# Altium project WQLT.PrjPcb
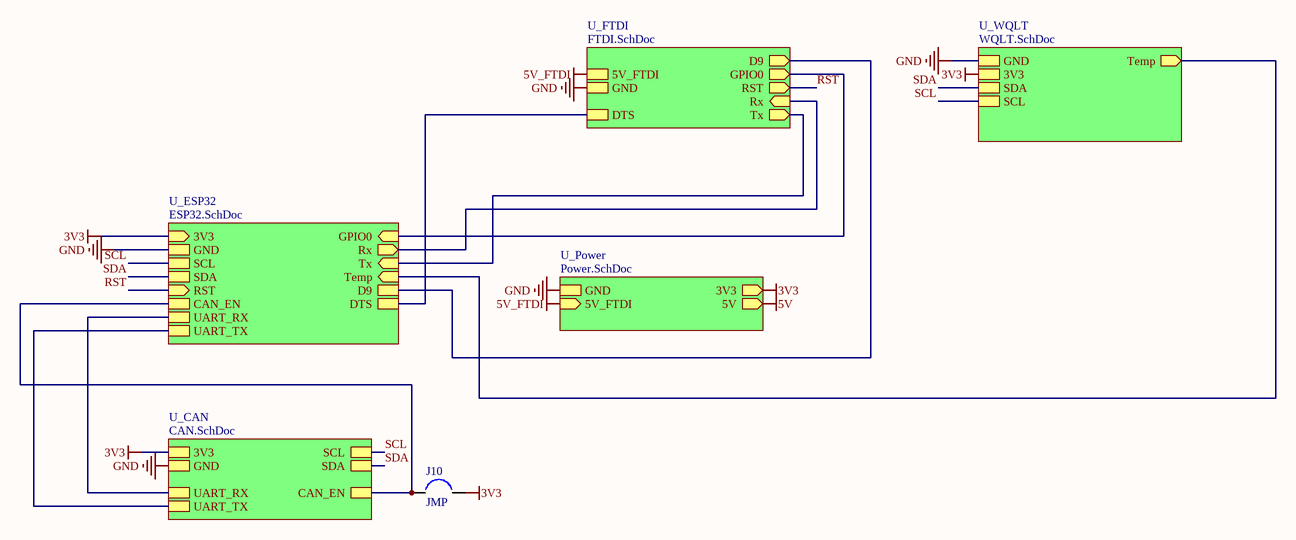
[diagram p0: MAIN.SchDoc]
13 sheets, 196 parts. Net scope: hierarchical (ports join the sheet entries above them; power ports are global).
Board file: PCB_WQLT.PcbDoc
Sheets:
  MAIN.SchDoc
    U_ESP32 = ESP32.SchDoc
    U_FTDI = FTDI.SchDoc
    U_WQLT = WQLT.SchDoc
      U_TDS_EZO_2 = TDS_EZO_2.SchDoc
      U_Temp = Temp.SchDoc
      U_DO_EZO_1 = DO_EZO_1.SchDoc
      U_TDS_EZO_1 = TDS_EZO_1.SchDoc
      U_DO_EZO_2 = DO_EZO_2.SchDoc
      U_pH_EZO_1 = pH_EZO_1.SchDoc
      U_pH_EZO_2 = pH_EZO_2.SchDoc
    U_Power = Power.SchDoc
    U_CAN = CAN.SchDoc

## Sheet MAIN.SchDoc
size A4

### Parts
J10  JMP  [Jumper]

### Sub-sheets
U_CAN = CAN.SchDoc: SDA, SCL, 3V3, CAN_EN, GND, UART_RX, UART_TX
U_ESP32 = ESP32.SchDoc: 3V3 (in), GND, SCL, SDA, GPIO0 (in), Temp (in), Tx (in), Rx (out), D9, RST (in), DTS, CAN_EN, UART_RX, UART_TX
U_FTDI = FTDI.SchDoc: D9 (out), RST (out), GND, Rx (in), Tx (out), 5V_FTDI, GPIO0 (out), DTS
U_Power = Power.SchDoc: 3V3 (out), GND, 5V (out), 5V_FTDI (in)
U_WQLT = WQLT.SchDoc: GND, Temp (out), 3V3, SDA, SCL

### Nets
3V3: J10.2 ; sheet U_ESP32/3V3, sheet U_WQLT/3V3, sheet U_Power/3V3, sheet U_CAN/3V3
5V_FTDI: sheet U_FTDI/5V_FTDI, sheet U_Power/5V_FTDI
GND: sheet U_ESP32/GND, sheet U_FTDI/GND, sheet U_WQLT/GND, sheet U_Power/GND, sheet U_CAN/GND
CAN_EN: J10.1 ; sheet U_ESP32/CAN_EN, sheet U_CAN/CAN_EN
D9: sheet U_ESP32/D9, sheet U_FTDI/D9
DTS: sheet U_ESP32/DTS, sheet U_FTDI/DTS
GPIO0: sheet U_ESP32/GPIO0, sheet U_FTDI/GPIO0
RST: sheet U_ESP32/RST, sheet U_FTDI/RST
Rx: sheet U_ESP32/Rx, sheet U_FTDI/Rx
SCL: sheet U_ESP32/SCL, sheet U_WQLT/SCL, sheet U_CAN/SCL
SDA: sheet U_ESP32/SDA, sheet U_WQLT/SDA, sheet U_CAN/SDA
Temp: sheet U_ESP32/Temp, sheet U_WQLT/Temp
Tx: sheet U_ESP32/Tx, sheet U_FTDI/Tx
UART_RX: sheet U_ESP32/UART_RX, sheet U_CAN/UART_RX
UART_TX: sheet U_ESP32/UART_TX, sheet U_CAN/UART_TX

## Sheet ESP32.SchDoc
size A4
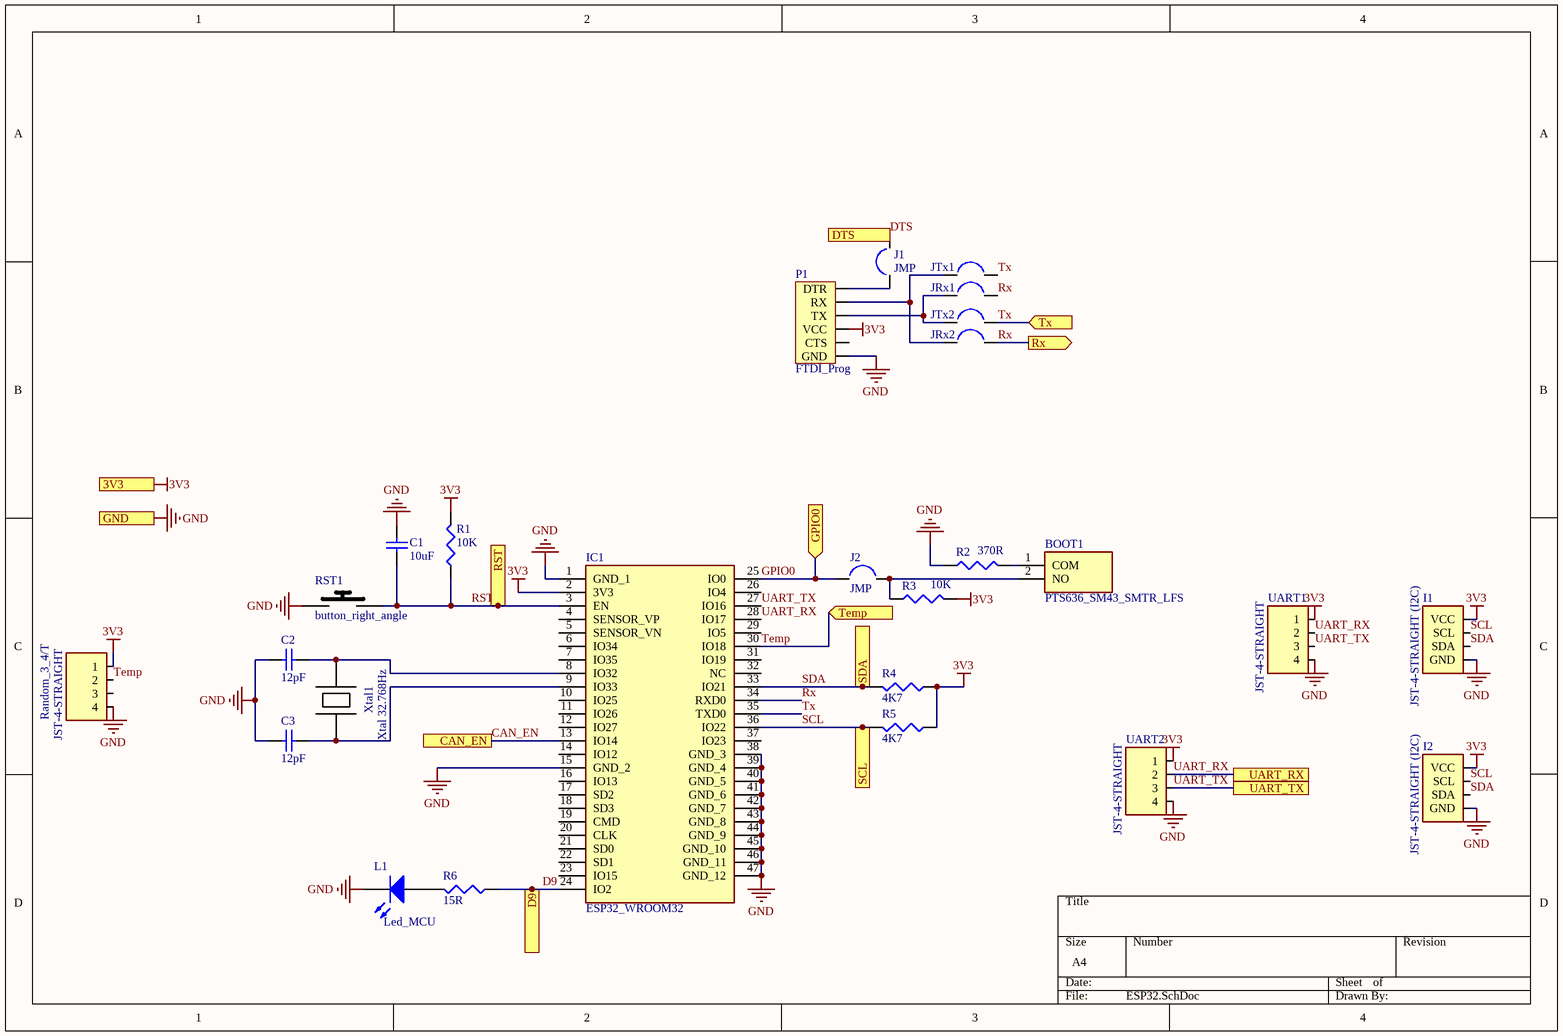
[diagram p1: ESP32.SchDoc]

### Parts
BOOT1  PTS636_SM43_SMTR_LFS  [PTS636SM43SMTRLFS]
C1  10uF  [1608[0603]]
C2  12pF  [1608[0603]]
C3  12pF  [1608[0603]]
I1  JST-4-STRAIGHT (I2C)  [JST-4-STRAIGHT]
I2  JST-4-STRAIGHT (I2C)  [JST-4-STRAIGHT]
IC1  ESP32_WROOM32  [ESP32WROOM32]
J1  JMP  [Jumper]
J2  JMP  [Jumper]
JRx1  JMP  [Jumper]  (value not drawn)
JRx2  JMP  [Jumper]  (value not drawn)
JTx1  JMP  [Jumper]  (value not drawn)
JTx2  JMP  [Jumper]  (value not drawn)
L1  Led_MCU  [LED 0603]
P1  FTDI_Prog  [programer]
R1  10K  [J1-0603]
R2  370R  [J1-0603]
R3  10K  [J1-0603]
R4  4K7  [J1-0603]
R5  4K7  [J1-0603]
R6  15R  [J1-0603]
Random_3_4/T  JST-4-STRAIGHT  [JST-4-STRAIGHT]
RST1  button_right_angle  [1825027-8]
UART1  JST-4-STRAIGHT  [JST-4-STRAIGHT]
UART2  JST-4-STRAIGHT  [JST-4-STRAIGHT]
Xtal1  Xtal 32.768Hz  [LFXTAL050789]

### Ports
3V3 (in), CAN_EN, D9, DTS, GND, GPIO0 (in), RST (in), Rx (out), SCL, SDA, Temp (in), Tx (in), UART_RX, UART_TX

### Nets
3V3: I1.1(VCC) I2.1(VCC) IC1.2(3V3) P1.4(VCC) R1.2 R3.2 R4.1 R5.1 Random_3_4/T.1 UART1.1 UART2.1 ; port 3V3
GND: C1.2 C2.2 C3.2 I1.4(GND) I2.4(GND) IC1.1(GND_1) IC1.15(GND_2) IC1.38(GND_3) IC1.39(GND_4) IC1.40(GND_5) IC1.41(GND_6) IC1.42(GND_7) IC1.43(GND_8) IC1.44(GND_9) IC1.45(GND_10) IC1.46(GND_11) IC1.47(GND_12) L1.2(K) P1.6(GND) R2.1 Random_3_4/T.4 RST1.1 UART1.4 UART2.4 ; port GND
CAN_EN: IC1.13(IO14) ; port CAN_EN
D9: IC1.24(IO2) R6.1 ; port D9
DTS: J1.2 ; port DTS
GPIO0: IC1.25(IO0) J2.1 ; port GPIO0
RST: C1.1 IC1.3(EN) R1.1 RST1.2 ; port RST
Rx: IC1.34(RXD0) JRx1.2 JRx2.2 ; port Rx
SCL: I1.2(SCL) I2.2(SCL) IC1.36(IO22) R5.2 ; port SCL
SDA: I1.3(SDA) I2.3(SDA) IC1.33(IO21) R4.2 ; port SDA
Temp: IC1.30(IO18) Random_3_4/T.2 ; port Temp
Tx: IC1.35(TXD0) JTx1.2 JTx2.2 ; port Tx
UART_RX: IC1.28(IO17) UART1.2 UART2.2 ; port UART_RX
UART_TX: IC1.27(IO16) UART1.3 UART2.3 ; port UART_TX
NetBOOT1_1: BOOT1.1(COM) R2.2
NetBOOT1_2: BOOT1.2(NO) J2.2 R3.1
NetC2_1: C2.1 IC1.8(IO32) Xtal1.2
NetC3_1: C3.1 IC1.9(IO33) Xtal1.1
NetJ1_1: J1.1 P1.1(DTR)
NetJRx1_1: JRx1.1 JTx2.1 P1.3(TX)
NetJRx2_1: JRx2.1 JTx1.1 P1.2(RX)
NetL1_1: L1.1(A) R6.2

Not connected (* = marked no-connect by the designer): IC1 4(SENSOR_VP) 5(SENSOR_VN) 6(IO34) 7(IO35) 10(IO25) 11(IO26) 12(IO27) 14(IO12) 16(IO13) 17(SD2) 18(SD3) 19(CMD) 20(CLK) 21(SD0) 22(SD1) 23(IO15) 26(IO4) 29(IO5) 31(IO19) 32(NC) 37(IO23); P1 5(CTS); Random_3_4/T 3

### Library data of the parts
BOOT1 = PTS636_SM43_SMTR_LFS: Switch; Manufacturer_Name: C & K COMPONENTS; Manufacturer_Part_Number: PTS636 SM43 SMTR LFS; Datasheet Link: https://componentsearchengine.com/Datasheets/1/PTS636 SM43 SMTR LFS.pdf; Height: 4.5mm; Mouser Part Number: 611-PTS636SM43SMTRLF; Mouser Price/Stock: https://www.mouser.co.uk/ProductDetail/CK/PTS636-SM43-SMTR-LFS?qs=vLWxofP3U2xu5raMGkTmHg%3D%3D; Arrow Part Number: PTS636 SM43 SMTR LFS; Arrow Price/Stock: https://www.arrow.com/en/products/pts636-sm43-smtr-lfs/ck
C1-C3 = Cap Semi: Capacitor (Semiconductor SIM Model); Published: 8-Jun-2000; LatestRevisionDate: 29-May-2009; LatestRevisionNote: IPC-7351 Footprint Added.; PackageReference: C1206; Publisher: Altium Limited; PackageDescription: Chip Capacitor
  C1: Value: 10uF
  C2 C3: Value: 12pF
IC1 = ESP32_WROOM32: Integrated Circuit; Manufacturer_Name: Espressif Systems; Manufacturer_Part_Number: ESP32 WROOM32; Datasheet Link: https://www.espressif.com/sites/default/files/documentation/esp32-wroom-32_datasheet_en.pdf; Height: 3.2mm
L1 = LED3: Typical BLUE SiC LED; Published: 8-Jun-2000; LatestRevisionDate: 17-Dec-2003; LatestRevisionNote: PCB Footprint replaced.; DatasheetVersion: 16-Apr-2002; PackageVersion: 16-Apr-2002; PackageReference: 3.5X2.8X1.9; Publisher: Altium Limited; PackageDescription: SM LED; 2 C-Bend Leads; Body 3.5 x 2.8 x 1.9 mm, inc leads (LxWxH typ)
P1 = Programer: FTDI_programer FT232RL USB TO TTL
R1-R6 = Res3: Resistor; Published: 8-Jun-2000; LatestRevisionDate: 29-May-2009; LatestRevisionNote: IPC-7351 Footprint Added.; PackageReference: J1-0603; Publisher: Altium Limited; PackageDescription: Chip Resistor
  R1 R3: Value: 10K
  R2: Value: 370R
  R4 R5: Value: 4K7
  R6: Value: 15R
RST1 = button_right_angle: Switch; Manufacturer_Name: TE Connectivity; Datasheet Link: http://www.te.com/commerce/DocumentDelivery/DDEController?Action=srchrtrv&DocNm=1825027&DocType=Customer+Drawing&DocLang=English; Manufacturer_Part_Number: 1825027-8; Mouser Part Number: 506-1825027-8; Mouser Price/Stock: https://www.mouser.com/Search/Refine.aspx?Keyword=506-1825027-8; RS Part Number: 7182389P; RS Price/Stock: http://uk.rs-online.com/web/p/products/7182389P
Xtal1 = Crystals WE-XTAL 32.7680kHz: 32.7680kHz; Shop: https://www.mouser.sk/ProductDetail/Wurth-Elektronik/830050789?qs=2WXlatMagcG%2Fhb4pC63Fuw%3D%3D

## Sheet FTDI.SchDoc
size A4
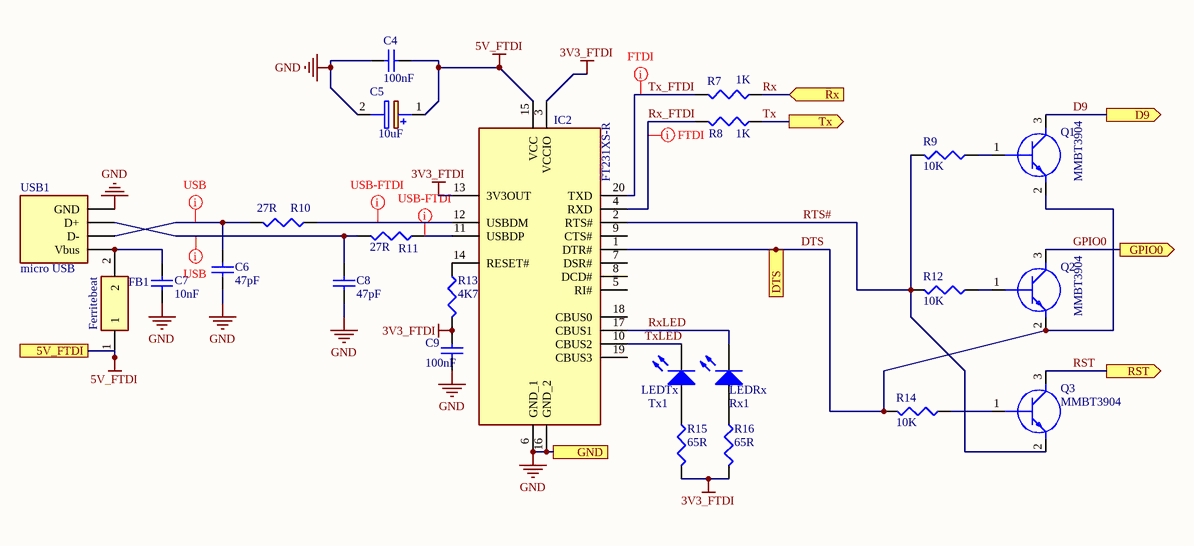
[diagram p2: FTDI.SchDoc]

### Parts
C4  100nF  [1608[0603]]
C5  10uF  [CAPPM3216X180N]
C6  47pF  [1608[0603]]
C7  10nF  [1608[0603]]
C8  47pF  [1608[0603]]
C9  100nF  [1608[0603]]
FB1  Ferritebeat  [BEADC1608X95N]
IC2  FT231XS-R  [SOP64P599X175-20N]
Q1  MMBT3904  [SOT95P230X110-3N]
Q2  MMBT3904  [SOT95P230X110-3N]
Q3  MMBT3904  [SOT95P230X110-3N]
R7  1K  [J1-0603]
R8  1K  [J1-0603]
R9  10K  [J1-0603]
R10  27R  [J1-0603]
R11  27R  [J1-0603]
R12  10K  [J1-0603]
R13  4K7  [J1-0603]
R14  10K  [J1-0603]
R15  65R  [J1-0603]
R16  65R  [J1-0603]
Rx1  LEDRx  [LED 0603]
Tx1  LEDTx  [LED 0603]
USB1  micro USB  [micro USB]

### Ports
5V_FTDI, D9 (out), DTS, GND, GPIO0 (out), RST (out), Rx (in), Tx (out)

### Nets
3V3_FTDI: C9.1 IC2.3(VCCIO) IC2.13(3V3OUT) R13.2 R15.2 R16.2
5V_FTDI: C4.2 C5.1(+) FB1.1 IC2.15(VCC) ; port 5V_FTDI
GND: C4.1 C5.2(-) C6.2 C7.1 C8.2 C9.2 IC2.6(GND_1) IC2.16(GND_2) USB1.5(GND) ; port GND
D9: Q1.3(C) ; port D9
DTS: IC2.1(DTR#) Q1.2(E) Q2.2(E) R14.2 ; port DTS
GPIO0: Q2.3(C) ; port GPIO0
RST: Q3.3(C) ; port RST
RTS#: IC2.2(RTS#) Q3.2(E) R9.2 R12.2
Rx: R7.1 ; port Rx
Rx_FTDI: IC2.4(RXD) R8.2
RxLED: IC2.17(CBUS1) Rx1.2(K)
Tx: R8.1 ; port Tx
Tx_FTDI: IC2.20(TXD) R7.2
TxLED: IC2.10(CBUS2) Tx1.2(K)
NetC6_1: C6.1 R10.2 USB1.2(D-)
NetC7_2: C7.2 FB1.2 USB1.1(Vbus)
NetC8_1: C8.1 R11.2 USB1.3(D+)
NetIC2_11: IC2.11(USBDP) R11.1
NetIC2_12: IC2.12(USBDM) R10.1
NetIC2_14: IC2.14(RESET#) R13.1
NetQ1_1: Q1.1(B) R9.1
NetQ2_1: Q2.1(B) R12.1
NetQ3_1: Q3.1(B) R14.1
NetR15_1: R15.1 Tx1.1(A)
NetR16_1: R16.1 Rx1.1(A)

Not connected (* = marked no-connect by the designer): IC2 5(RI#) 7(DSR#) 8(DCD#) 9(CTS#) 18(CBUS0) 19(CBUS3)

### Layout directives
net class USB: NetC6_1, NetC8_1
net class FTDI: Rx_FTDI, Tx_FTDI
net class USB-FTDI: NetIC2_11, NetIC2_12

### Library data of the parts
C4 C9 = Cap Semi: Capacitor (Semiconductor SIM Model); Value: 47pF; Published: 8-Jun-2000; LatestRevisionDate: 29-May-2009; LatestRevisionNote: IPC-7351 Footprint Added.; PackageReference: C1206; Publisher: Altium Limited; PackageDescription: Chip Capacitor
C5 = TAJA106K004RNJ: Capacitor Polarised; Manufacturer_Name: AVX; Datasheet Link: http://www.farnell.com/datasheets/1680476.pdf; Height: 1.8mm; Manufacturer_Part_Number: TAJA106K004RNJ; Mouser Part Number: 581-TAJA106K004R; Mouser Price/Stock: https://www.mouser.com/Search/Refine.aspx?Keyword=581-TAJA106K004R
C6-C8 = Cap Semi: Capacitor (Semiconductor SIM Model); Published: 8-Jun-2000; LatestRevisionDate: 29-May-2009; LatestRevisionNote: IPC-7351 Footprint Added.; PackageReference: C1206; Publisher: Altium Limited; PackageDescription: Chip Capacitor
  C6 C8: Value: 47pF
  C7: Value: 10nF
FB1 = BLM18DN151SH1D: Ferrite Bead; Manufacturer_Name: Murata Electronics; Datasheet Link: http://www.murata.com/~/media/webrenewal/support/library/catalog/products/emc/emifil/c31e.ashx?la=en-gb; Height: 0.95mm; Manufacturer_Part_Number: BLM18DN151SH1D; Mouser Part Number: 81-BLM18DN151SH1D; Mouser Price/Stock: https://www.mouser.com/Search/Refine.aspx?Keyword=81-BLM18DN151SH1D
IC2 = FT231XS-R: Integrated Circuit; Manufacturer_Name: FTDI Chip; Datasheet Link: http://docs-emea.rs-online.com/webdocs/1102/0900766b811020d3.pdf; Height: 1.753mm; Manufacturer_Part_Number: FT231XS-R; Mouser Part Number: 895-FT231XS-R; Mouser Price/Stock: https://www.mouser.co.uk/ProductDetail/FTDI/FT231XS-R?qs=Gp1Yz1mis3WduRPsgrTbtg%3D%3D; Arrow Part Number: FT231XS-R; Arrow Price/Stock: https://www.arrow.com/en/products/ft231xs-r/ftdi-chip
Q1-Q3 = MMBT3904,215: Transistor BJT NPN; Manufacturer_Name: Nexperia; Datasheet Link: http://assets.nexperia.com/documents/data-sheet/MMBT3904.pdf; Height: 1.1mm; Manufacturer_Part_Number: MMBT3904,215; Mouser Part Number: 771-MMBT3904T/R; Mouser Price/Stock: https://www.mouser.co.uk/ProductDetail/Nexperia/MMBT3904215?qs=LOCUfHb8d9s%2FW6hzAJGDbw%3D%3D; Arrow Part Number: MMBT3904,215; Arrow Price/Stock: https://www.arrow.com/en/products/mmbt3904215/nexperia?region=europe
R7-R16 = Res3: Resistor; Published: 8-Jun-2000; LatestRevisionDate: 29-May-2009; LatestRevisionNote: IPC-7351 Footprint Added.; PackageReference: J1-0603; Publisher: Altium Limited; PackageDescription: Chip Resistor
  R7 R8: Value: 1K
  R9 R12 R14: Value: 10K
  R10 R11: Value: 27R
  R13: Value: 4K7
  R15 R16: Value: 65R
Rx1 Tx1 = LED3: Typical BLUE SiC LED; Published: 8-Jun-2000; LatestRevisionDate: 17-Dec-2003; LatestRevisionNote: PCB Footprint replaced.; DatasheetVersion: 16-Apr-2002; PackageVersion: 16-Apr-2002; PackageReference: 3.5X2.8X1.9; Publisher: Altium Limited; PackageDescription: SM LED; 2 C-Bend Leads; Body 3.5 x 2.8 x 1.9 mm, inc leads (LxWxH typ)

## Sheet WQLT.SchDoc
size A4
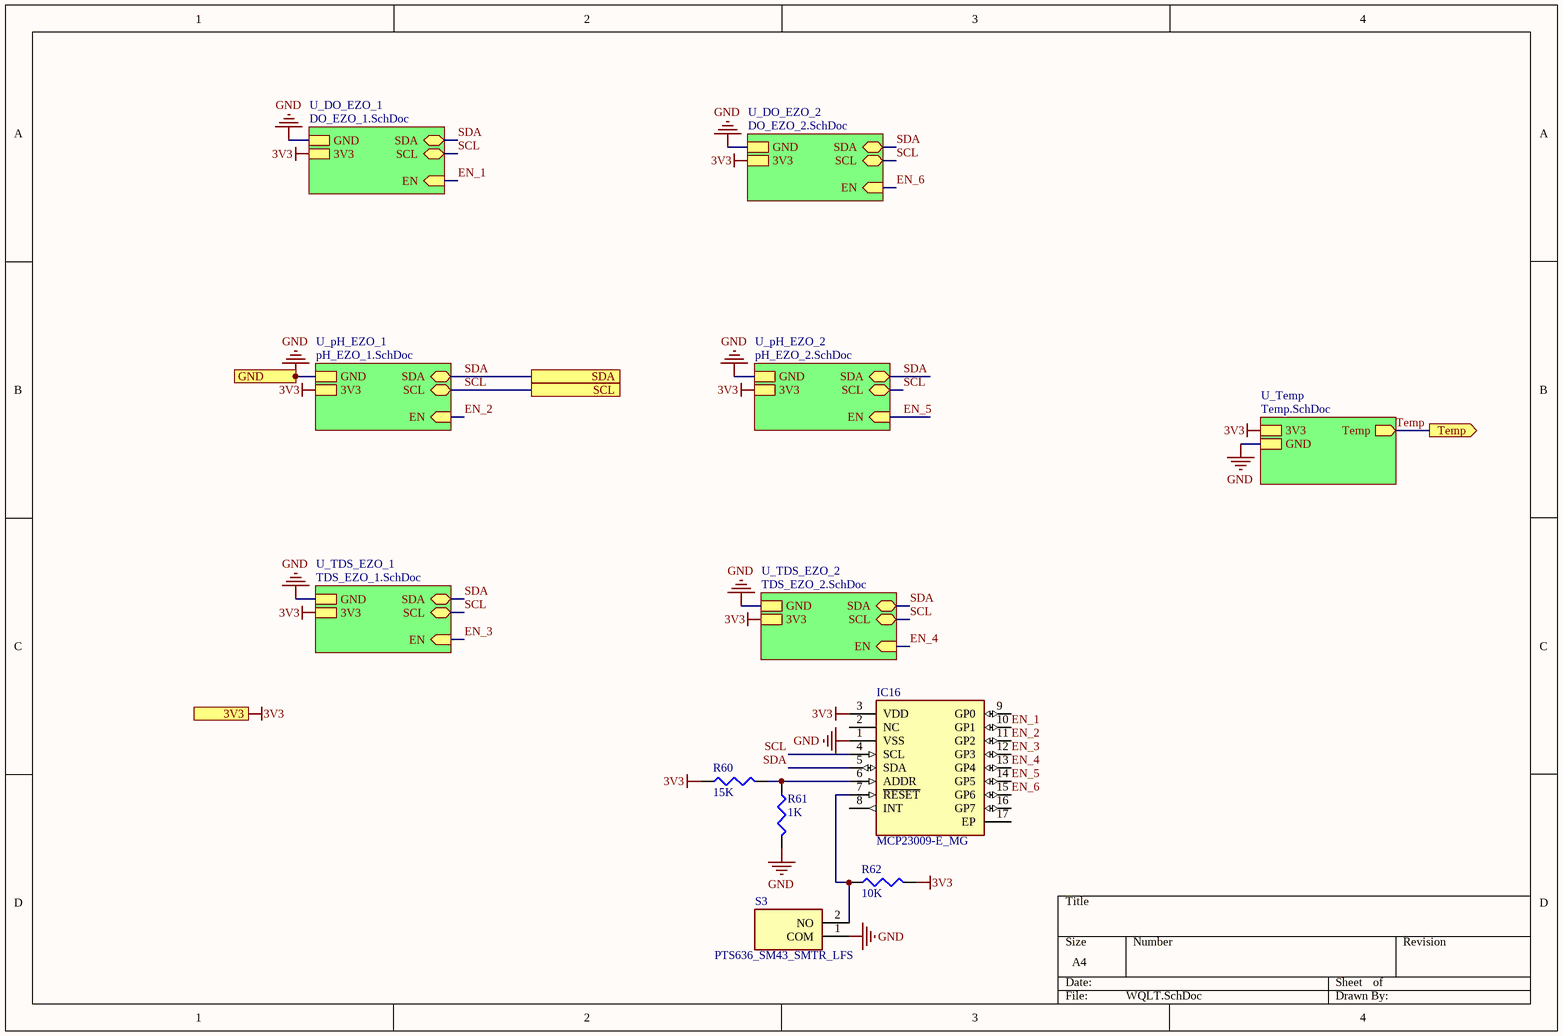
[diagram p3: WQLT.SchDoc]

### Parts
IC16  MCP23009-E_MG  [QFN50P300X300X90-17N-D]
R60  15K  [J1-0603]
R61  1K  [J1-0603]
R62  10K  [J1-0603]
S3  PTS636_SM43_SMTR_LFS  [PTS636SM43SMTRLFS]

### Sub-sheets
U_DO_EZO_1 = DO_EZO_1.SchDoc: SCL (bidir), GND, EN (in), SDA (bidir), 3V3
U_DO_EZO_2 = DO_EZO_2.SchDoc: SCL (bidir), GND, EN (in), SDA (bidir), 3V3
U_pH_EZO_1 = pH_EZO_1.SchDoc: SDA (bidir), EN (in), SCL (bidir), GND, 3V3
U_pH_EZO_2 = pH_EZO_2.SchDoc: SDA (bidir), EN (in), 3V3, SCL (bidir), GND
U_TDS_EZO_1 = TDS_EZO_1.SchDoc: SDA (bidir), EN (in), SCL (bidir), 3V3, GND
U_TDS_EZO_2 = TDS_EZO_2.SchDoc: SDA (bidir), EN (in), SCL (bidir), 3V3, GND
U_Temp = Temp.SchDoc: 3V3, Temp (out), GND

### Ports
3V3, GND, SCL, SDA, Temp (out)

### Nets
3V3: IC16.3(VDD) R60.1 R62.2 ; port 3V3, sheet U_TDS_EZO_2/3V3, sheet U_Temp/3V3, sheet U_DO_EZO_1/3V3, sheet U_TDS_EZO_1/3V3, sheet U_DO_EZO_2/3V3, sheet U_pH_EZO_1/3V3, sheet U_pH_EZO_2/3V3
GND: IC16.1(VSS) R61.2 S3.1(COM) ; port GND, sheet U_TDS_EZO_2/GND, sheet U_Temp/GND, sheet U_DO_EZO_1/GND, sheet U_TDS_EZO_1/GND, sheet U_DO_EZO_2/GND, sheet U_pH_EZO_1/GND, sheet U_pH_EZO_2/GND
EN_1: IC16.10(GP1) ; sheet U_DO_EZO_1/EN
EN_2: IC16.11(GP2) ; sheet U_pH_EZO_1/EN
EN_3: IC16.12(GP3) ; sheet U_TDS_EZO_1/EN
EN_4: IC16.13(GP4) ; sheet U_TDS_EZO_2/EN
EN_5: IC16.14(GP5) ; sheet U_pH_EZO_2/EN
EN_6: IC16.15(GP6) ; sheet U_DO_EZO_2/EN
SCL: IC16.4(SCL) ; port SCL, sheet U_TDS_EZO_2/SCL, sheet U_DO_EZO_1/SCL, sheet U_TDS_EZO_1/SCL, sheet U_DO_EZO_2/SCL, sheet U_pH_EZO_1/SCL, sheet U_pH_EZO_2/SCL
SDA: IC16.5(SDA) ; port SDA, sheet U_TDS_EZO_2/SDA, sheet U_DO_EZO_1/SDA, sheet U_TDS_EZO_1/SDA, sheet U_DO_EZO_2/SDA, sheet U_pH_EZO_1/SDA, sheet U_pH_EZO_2/SDA
Temp: port Temp, sheet U_Temp/Temp
NetIC16_6: IC16.6(ADDR) R60.2 R61.1
NetIC16_7: IC16.7(~{RESET}) R62.1 S3.2(NO)

Not connected (* = marked no-connect by the designer): IC16 2(NC) 8(INT) 9(GP0) 16(GP7) 17(EP)

### Library data of the parts
IC16 = MCP23009-E_MG: Integrated Circuit; Manufacturer_Name: Microchip; Manufacturer_Part_Number: MCP23009-E/MG; Datasheet Link: http://ww1.microchip.com/downloads/en/DeviceDoc/20002121C.pdf; Height: 0.9mm; Mouser Part Number: 579-MCP23009-E/MG; Mouser Price/Stock: https://www.mouser.co.uk/ProductDetail/Microchip-Technology/MCP23009-E-MG?qs=Xb8IjHhkxj5%2FhepKZpS8CQ%3D%3D; Arrow Part Number: MCP23009-E/MG; Arrow Price/Stock: https://www.arrow.com/en/products/mcp23009-emg/microchip-technology
R60-R62 = Res3: Resistor; Published: 8-Jun-2000; LatestRevisionDate: 29-May-2009; LatestRevisionNote: IPC-7351 Footprint Added.; PackageReference: J1-0603; Publisher: Altium Limited; PackageDescription: Chip Resistor
  R60: Value: 15K
  R61: Value: 1K
  R62: Value: 10K
S3 = PTS636_SM43_SMTR_LFS: as BOOT1 on sheet ESP32; Datasheet Link: https://componentsearchengine.com/Datasheets/1/PTS636 SM43 SMTR LFS.pdf; Height: 4.5mm; Mouser Part Number: 611-PTS636SM43SMTRLF; Mouser Price/Stock: https://www.mouser.co.uk/ProductDetail/CK/PTS636-SM43-SMTR-LFS?qs=vLWxofP3U2xu5raMGkTmHg%3D%3D; Arrow Part Number: PTS636 SM43 SMTR LFS; Arrow Price/Stock: https://www.arrow.com/en/products/pts636-sm43-smtr-lfs/ck

## Sheet TDS_EZO_2.SchDoc
size A4
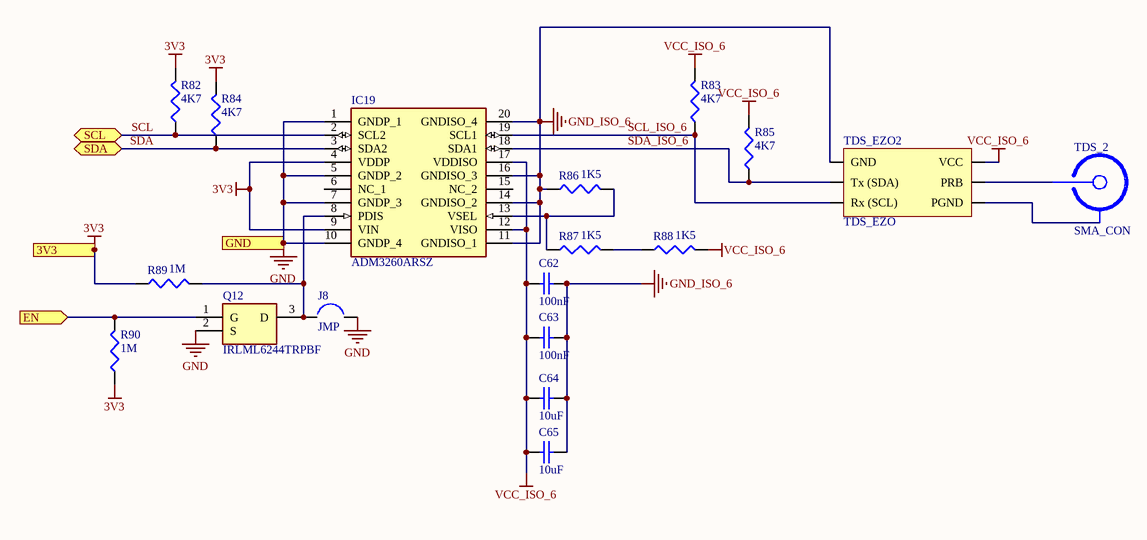
[diagram p4: TDS_EZO_2.SchDoc]

### Parts
C62  100nF  [1608[0603]]
C63  100nF  [1608[0603]]
C64  10uF  [1608[0603]]
C65  10uF  [1608[0603]]
IC19  ADM3260ARSZ  [SOP65P780X200-20N]
J8  JMP  [Jumper]
Q12  IRLML6244TRPBF  [SOT95P237X112-3N]
R82  4K7  [J1-0603]
R83  4K7  [J1-0603]
R84  4K7  [J1-0603]
R85  4K7  [J1-0603]
R86  1K5  [J1-0603]
R87  1K5  [J1-0603]
R88  1K5  [J1-0603]
R89  1M  [J1-0603]
R90  1M  [J1-0603]
TDS_2  SMA_CON  [PCBSMAFRAHT]
TDS_EZO2  TDS_EZO  [TDS_EZO]

### Ports
3V3, EN (in), GND, SCL (bidir), SDA (bidir)

### Nets
3V3: IC19.4(VDDP) IC19.9(VIN) R82.2 R84.2 R89.1 R90.1 ; port 3V3
GND: IC19.1(GNDP_1) IC19.5(GNDP_2) IC19.7(GNDP_3) IC19.10(GNDP_4) J8.2 Q12.2(S) ; port GND
GND_ISO_6: C62.2 C63.2 C64.2 C65.2 IC19.11(GNDISO_1) IC19.14(GNDISO_2) IC19.16(GNDISO_3) IC19.20(GNDISO_4) R86.1 TDS_EZO2.1(GND)
VCC_ISO_6: C62.1 C63.1 C64.1 C65.1 IC19.12(VISO) IC19.17(VDDISO) R83.2 R85.2 R88.2 TDS_EZO2.4(VCC)
EN_4: Q12.1(G) R90.2 ; port EN
SCL: IC19.2(SCL2) R82.1 ; port SCL
SCL_ISO_6: IC19.19(SCL1) R83.1 TDS_EZO2.3(Rx_(SCL))
SDA: IC19.3(SDA2) R84.1 ; port SDA
SDA_ISO_6: IC19.18(SDA1) R85.1 TDS_EZO2.2(Tx_(SDA))
NetIC19_8: IC19.8(PDIS) J8.1 Q12.3(D) R89.2
NetIC19_13: IC19.13(VSEL) R86.2 R87.1
NetR87_2: R87.2 R88.1
NetTDS_2_1: TDS_2.1 TDS_EZO2.5(PRB)
NetTDS_2_2: TDS_2.2 TDS_EZO2.6(PGND)

Not connected (* = marked no-connect by the designer): IC19 6(NC_1) 15(NC_2)

### Library data of the parts
C62 C63 = Cap Semi: Capacitor (Semiconductor SIM Model); Published: 8-Jun-2000; LatestRevisionDate: 29-May-2009; LatestRevisionNote: IPC-7351 Footprint Added.; PackageReference: C1206; Publisher: Altium Limited; PackageDescription: Chip Capacitor; Value: 100nF
C64 C65 = Cap Semi: Capacitor (Semiconductor SIM Model); Value: 100nF; Published: 8-Jun-2000; LatestRevisionDate: 29-May-2009; LatestRevisionNote: IPC-7351 Footprint Added.; PackageReference: C1206; Publisher: Altium Limited; PackageDescription: Chip Capacitor
IC19 = ADM3260ARSZ: Integrated Circuit; Manufacturer_Name: Analog Devices; Datasheet Link: http://www.farnell.com/datasheets/2037088.pdf; Height: 2mm; Manufacturer_Part_Number: ADM3260ARSZ; Mouser Part Number: 584-ADM3260ARSZ; Mouser Price/Stock: https://www.mouser.com/Search/Refine.aspx?Keyword=584-ADM3260ARSZ; RS Part Number: 8319113P; RS Price/Stock: http://uk.rs-online.com/web/p/products/8319113P
Q12 = IRLML6244TRPBF: Transistor; Manufacturer_Name: Infineon; Allied_Number: 70411468; Datasheet Link: http://www.infineon.com/dgdl/irlml6244pbf.pdf?fileId=5546d462533600a4015356686fed261f; Height: 1.12mm; Manufacturer_Part_Number: IRLML6244TRPBF; Mouser Part Number: 942-IRLML6244TRPBF; Mouser Price/Stock: https://www.mouser.com/Search/Refine.aspx?Keyword=942-IRLML6244TRPBF; RS Part Number: 7377228P; RS Price/Stock: http://at.rs-online.com/web/p/products/7377228P; Allied Price/Stock: https://www.alliedelec.com/infineon-irlml6244trpbf/70411468/
R82-R90 = Res3: Resistor; Published: 8-Jun-2000; LatestRevisionDate: 29-May-2009; LatestRevisionNote: IPC-7351 Footprint Added.; PackageReference: J1-0603; Publisher: Altium Limited; PackageDescription: Chip Resistor
  R82-R85: Value: 4K7
  R86-R88: Value: 1K5
  R89 R90: Value: 1M
TDS_2 = SMA: Connector; Manufacturer_Name: Taoglas; Manufacturer_Part_Number: PCB.SMAFRA.HT; Datasheet Link: https://www.mouser.com/datasheet/2/398/PCB.SMAFRA.HT_-1220750.pdf; Height: 9mm; Mouser Part Number: 960-PCB.SMAFRA.HT; Mouser Price/Stock: https://www.mouser.co.uk/ProductDetail/Taoglas/PCBSMAFRAHT?qs=RuW%2Fu%252BNMQmubIFYcN8w5Dw%3D%3D

## Sheet Temp.SchDoc
size A4
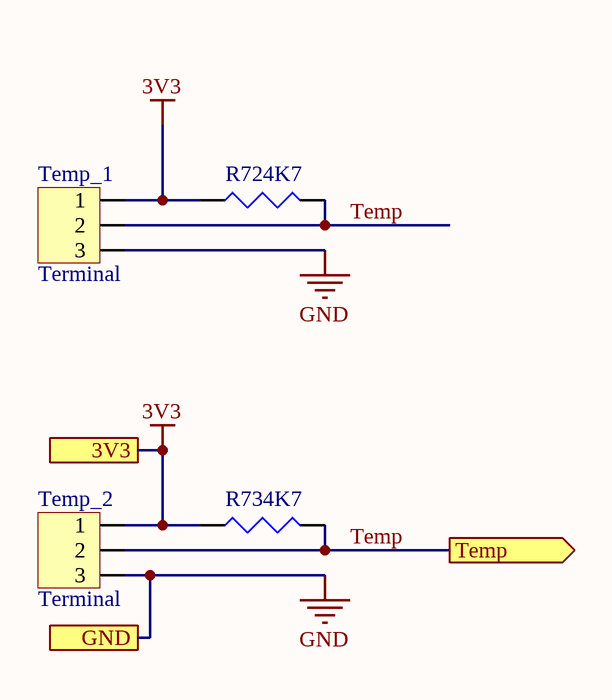
[diagram p5: Temp.SchDoc]

### Parts
R72  4K7  [J1-0603]
R73  4K7  [J1-0603]
Temp_1  Terminal  [2,54 3pin terminal]
Temp_2  Terminal  [2,54 3pin terminal]

### Ports
3V3, GND, Temp (out)

### Nets
3V3: R72.1 R73.1 Temp_1.1 Temp_2.1 ; port 3V3
GND: Temp_1.3 Temp_2.3 ; port GND
Temp: R72.2 R73.2 Temp_1.2 Temp_2.2 ; port Temp

### Library data of the parts
R72 R73 = Res3: Resistor; Published: 8-Jun-2000; LatestRevisionDate: 29-May-2009; LatestRevisionNote: IPC-7351 Footprint Added.; PackageReference: J1-0603; Publisher: Altium Limited; PackageDescription: Chip Resistor; Value: 4K7
Temp_1 Temp_2 = 2,54 3pin terminal

## Sheet DO_EZO_1.SchDoc
size A4
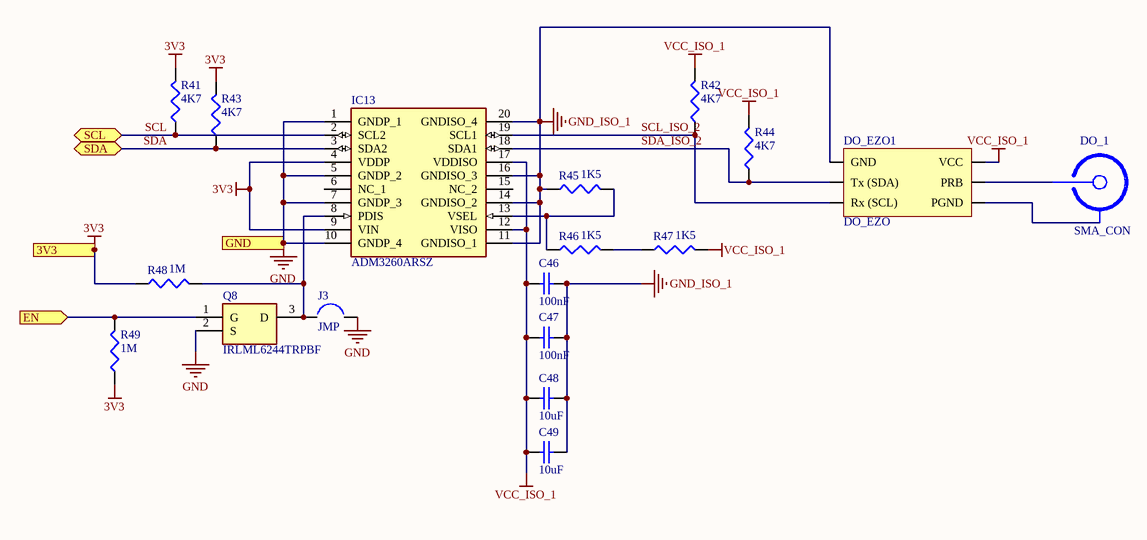
[diagram p6: DO_EZO_1.SchDoc]

### Parts
C46  100nF  [1608[0603]]
C47  100nF  [1608[0603]]
C48  10uF  [1608[0603]]
C49  10uF  [1608[0603]]
DO_1  SMA_CON  [PCBSMAFRAHT]
DO_EZO1  DO_EZO  [DO_EZO]
IC13  ADM3260ARSZ  [SOP65P780X200-20N]
J3  JMP  [Jumper]
Q8  IRLML6244TRPBF  [SOT95P237X112-3N]
R41  4K7  [J1-0603]
R42  4K7  [J1-0603]
R43  4K7  [J1-0603]
R44  4K7  [J1-0603]
R45  1K5  [J1-0603]
R46  1K5  [J1-0603]
R47  1K5  [J1-0603]
R48  1M  [J1-0603]
R49  1M  [J1-0603]

### Ports
3V3, EN (in), GND, SCL (bidir), SDA (bidir)

### Nets
3V3: IC13.4(VDDP) IC13.9(VIN) R41.2 R43.2 R48.1 R49.1 ; port 3V3
GND: IC13.1(GNDP_1) IC13.5(GNDP_2) IC13.7(GNDP_3) IC13.10(GNDP_4) J3.2 Q8.2(S) ; port GND
GND_ISO_1: C46.2 C47.2 C48.2 C49.2 DO_EZO1.1(GND) IC13.11(GNDISO_1) IC13.14(GNDISO_2) IC13.16(GNDISO_3) IC13.20(GNDISO_4) R45.1
VCC_ISO_1: C46.1 C47.1 C48.1 C49.1 DO_EZO1.4(VCC) IC13.12(VISO) IC13.17(VDDISO) R42.2 R44.2 R47.2
EN_1: Q8.1(G) R49.2 ; port EN
SCL: IC13.2(SCL2) R41.1 ; port SCL
SCL_ISO_2: DO_EZO1.3(Rx_(SCL)) IC13.19(SCL1) R42.1
SDA: IC13.3(SDA2) R43.1 ; port SDA
SDA_ISO_2: DO_EZO1.2(Tx_(SDA)) IC13.18(SDA1) R44.1
NetDO_1_1: DO_1.1 DO_EZO1.5(PRB)
NetDO_1_2: DO_1.2 DO_EZO1.6(PGND)
NetIC13_8: IC13.8(PDIS) J3.1 Q8.3(D) R48.2
NetIC13_13: IC13.13(VSEL) R45.2 R46.1
NetR46_2: R46.2 R47.1

Not connected (* = marked no-connect by the designer): IC13 6(NC_1) 15(NC_2)

### Library data of the parts
C46 C47 = Cap Semi: Capacitor (Semiconductor SIM Model); Published: 8-Jun-2000; LatestRevisionDate: 29-May-2009; LatestRevisionNote: IPC-7351 Footprint Added.; PackageReference: C1206; Publisher: Altium Limited; PackageDescription: Chip Capacitor; Value: 100nF
C48 C49 = Cap Semi: as C64 on sheet TDS_EZO_2; Published: 8-Jun-2000; LatestRevisionDate: 29-May-2009; LatestRevisionNote: IPC-7351 Footprint Added.; PackageReference: C1206; Publisher: Altium Limited; PackageDescription: Chip Capacitor
DO_1 = SMA: as TDS_2 on sheet TDS_EZO_2; Datasheet Link: https://www.mouser.com/datasheet/2/398/PCB.SMAFRA.HT_-1220750.pdf; Height: 9mm; Mouser Part Number: 960-PCB.SMAFRA.HT; Mouser Price/Stock: https://www.mouser.co.uk/ProductDetail/Taoglas/PCBSMAFRAHT?qs=RuW%2Fu%252BNMQmubIFYcN8w5Dw%3D%3D
IC13 = ADM3260ARSZ: as IC19 on sheet TDS_EZO_2; Datasheet Link: http://www.farnell.com/datasheets/2037088.pdf; Height: 2mm; Manufacturer_Part_Number: ADM3260ARSZ; Mouser Part Number: 584-ADM3260ARSZ; Mouser Price/Stock: https://www.mouser.com/Search/Refine.aspx?Keyword=584-ADM3260ARSZ; RS Part Number: 8319113P; RS Price/Stock: http://uk.rs-online.com/web/p/products/8319113P
Q8 = IRLML6244TRPBF: as Q12 on sheet TDS_EZO_2; Datasheet Link: http://www.infineon.com/dgdl/irlml6244pbf.pdf?fileId=5546d462533600a4015356686fed261f; Height: 1.12mm; Manufacturer_Part_Number: IRLML6244TRPBF; Mouser Part Number: 942-IRLML6244TRPBF; Mouser Price/Stock: https://www.mouser.com/Search/Refine.aspx?Keyword=942-IRLML6244TRPBF; RS Part Number: 7377228P; RS Price/Stock: http://at.rs-online.com/web/p/products/7377228P; Allied Price/Stock: https://www.alliedelec.com/infineon-irlml6244trpbf/70411468/
R41-R49 = Res3: Resistor; Published: 8-Jun-2000; LatestRevisionDate: 29-May-2009; LatestRevisionNote: IPC-7351 Footprint Added.; PackageReference: J1-0603; Publisher: Altium Limited; PackageDescription: Chip Resistor
  R41-R44: Value: 4K7
  R45-R47: Value: 1K5
  R48 R49: Value: 1M

## Sheet TDS_EZO_1.SchDoc
size A4
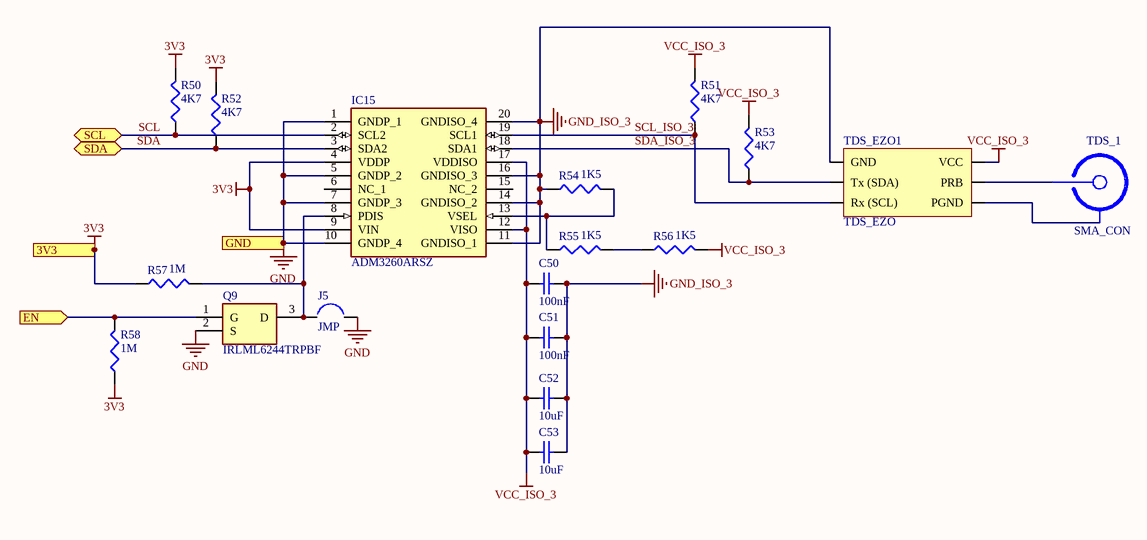
[diagram p7: TDS_EZO_1.SchDoc]

### Parts
C50  100nF  [1608[0603]]
C51  100nF  [1608[0603]]
C52  10uF  [1608[0603]]
C53  10uF  [1608[0603]]
IC15  ADM3260ARSZ  [SOP65P780X200-20N]
J5  JMP  [Jumper]
Q9  IRLML6244TRPBF  [SOT95P237X112-3N]
R50  4K7  [J1-0603]
R51  4K7  [J1-0603]
R52  4K7  [J1-0603]
R53  4K7  [J1-0603]
R54  1K5  [J1-0603]
R55  1K5  [J1-0603]
R56  1K5  [J1-0603]
R57  1M  [J1-0603]
R58  1M  [J1-0603]
TDS_1  SMA_CON  [PCBSMAFRAHT]
TDS_EZO1  TDS_EZO  [TDS_EZO]

### Ports
3V3, EN (in), GND, SCL (bidir), SDA (bidir)

### Nets
3V3: IC15.4(VDDP) IC15.9(VIN) R50.2 R52.2 R57.1 R58.1 ; port 3V3
GND: IC15.1(GNDP_1) IC15.5(GNDP_2) IC15.7(GNDP_3) IC15.10(GNDP_4) J5.2 Q9.2(S) ; port GND
GND_ISO_3: C50.2 C51.2 C52.2 C53.2 IC15.11(GNDISO_1) IC15.14(GNDISO_2) IC15.16(GNDISO_3) IC15.20(GNDISO_4) R54.1 TDS_EZO1.1(GND)
VCC_ISO_3: C50.1 C51.1 C52.1 C53.1 IC15.12(VISO) IC15.17(VDDISO) R51.2 R53.2 R56.2 TDS_EZO1.4(VCC)
EN_3: Q9.1(G) R58.2 ; port EN
SCL: IC15.2(SCL2) R50.1 ; port SCL
SCL_ISO_3: IC15.19(SCL1) R51.1 TDS_EZO1.3(Rx_(SCL))
SDA: IC15.3(SDA2) R52.1 ; port SDA
SDA_ISO_3: IC15.18(SDA1) R53.1 TDS_EZO1.2(Tx_(SDA))
NetIC15_8: IC15.8(PDIS) J5.1 Q9.3(D) R57.2
NetIC15_13: IC15.13(VSEL) R54.2 R55.1
NetR55_2: R55.2 R56.1
NetTDS_1_1: TDS_1.1 TDS_EZO1.5(PRB)
NetTDS_1_2: TDS_1.2 TDS_EZO1.6(PGND)

Not connected (* = marked no-connect by the designer): IC15 6(NC_1) 15(NC_2)

### Library data of the parts
C50 C51 = Cap Semi: Capacitor (Semiconductor SIM Model); Published: 8-Jun-2000; LatestRevisionDate: 29-May-2009; LatestRevisionNote: IPC-7351 Footprint Added.; PackageReference: C1206; Publisher: Altium Limited; PackageDescription: Chip Capacitor; Value: 100nF
C52 C53 = Cap Semi: as C64 on sheet TDS_EZO_2; Published: 8-Jun-2000; LatestRevisionDate: 29-May-2009; LatestRevisionNote: IPC-7351 Footprint Added.; PackageReference: C1206; Publisher: Altium Limited; PackageDescription: Chip Capacitor
IC15 = ADM3260ARSZ: as IC19 on sheet TDS_EZO_2; Datasheet Link: http://www.farnell.com/datasheets/2037088.pdf; Height: 2mm; Manufacturer_Part_Number: ADM3260ARSZ; Mouser Part Number: 584-ADM3260ARSZ; Mouser Price/Stock: https://www.mouser.com/Search/Refine.aspx?Keyword=584-ADM3260ARSZ; RS Part Number: 8319113P; RS Price/Stock: http://uk.rs-online.com/web/p/products/8319113P
Q9 = IRLML6244TRPBF: as Q12 on sheet TDS_EZO_2; Datasheet Link: http://www.infineon.com/dgdl/irlml6244pbf.pdf?fileId=5546d462533600a4015356686fed261f; Height: 1.12mm; Manufacturer_Part_Number: IRLML6244TRPBF; Mouser Part Number: 942-IRLML6244TRPBF; Mouser Price/Stock: https://www.mouser.com/Search/Refine.aspx?Keyword=942-IRLML6244TRPBF; RS Part Number: 7377228P; RS Price/Stock: http://at.rs-online.com/web/p/products/7377228P; Allied Price/Stock: https://www.alliedelec.com/infineon-irlml6244trpbf/70411468/
R50-R58 = Res3: Resistor; Published: 8-Jun-2000; LatestRevisionDate: 29-May-2009; LatestRevisionNote: IPC-7351 Footprint Added.; PackageReference: J1-0603; Publisher: Altium Limited; PackageDescription: Chip Resistor
  R50-R53: Value: 4K7
  R54-R56: Value: 1K5
  R57 R58: Value: 1M
TDS_1 = SMA: as TDS_2 on sheet TDS_EZO_2; Datasheet Link: https://www.mouser.com/datasheet/2/398/PCB.SMAFRA.HT_-1220750.pdf; Height: 9mm; Mouser Part Number: 960-PCB.SMAFRA.HT; Mouser Price/Stock: https://www.mouser.co.uk/ProductDetail/Taoglas/PCBSMAFRAHT?qs=RuW%2Fu%252BNMQmubIFYcN8w5Dw%3D%3D

## Sheet DO_EZO_2.SchDoc
size A4
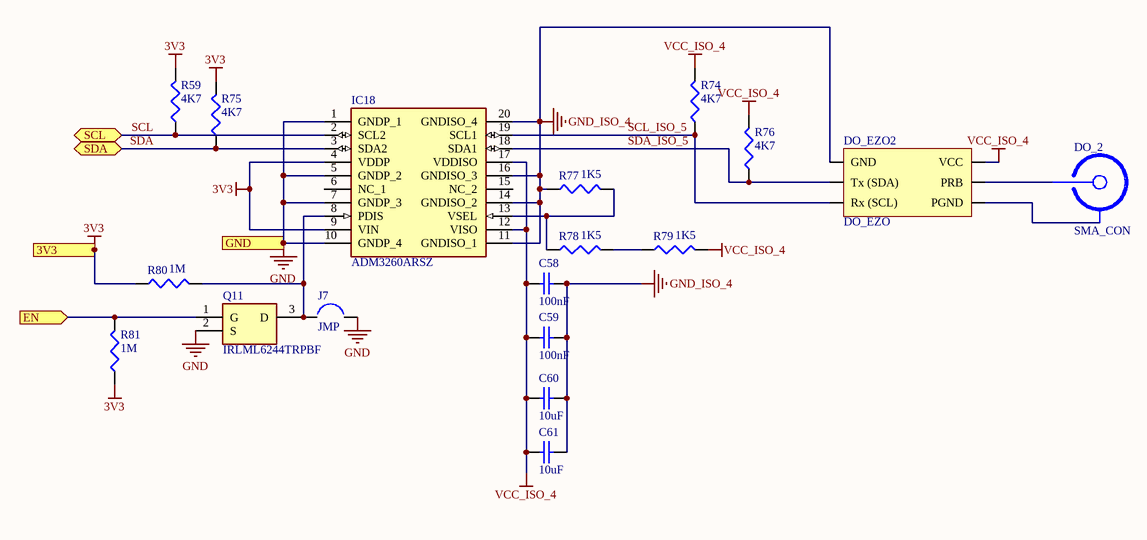
[diagram p8: DO_EZO_2.SchDoc]

### Parts
C58  100nF  [1608[0603]]
C59  100nF  [1608[0603]]
C60  10uF  [1608[0603]]
C61  10uF  [1608[0603]]
DO_2  SMA_CON  [PCBSMAFRAHT]
DO_EZO2  DO_EZO  [DO_EZO]
IC18  ADM3260ARSZ  [SOP65P780X200-20N]
J7  JMP  [Jumper]
Q11  IRLML6244TRPBF  [SOT95P237X112-3N]
R59  4K7  [J1-0603]
R74  4K7  [J1-0603]
R75  4K7  [J1-0603]
R76  4K7  [J1-0603]
R77  1K5  [J1-0603]
R78  1K5  [J1-0603]
R79  1K5  [J1-0603]
R80  1M  [J1-0603]
R81  1M  [J1-0603]

### Ports
3V3, EN (in), GND, SCL (bidir), SDA (bidir)

### Nets
3V3: IC18.4(VDDP) IC18.9(VIN) R59.2 R75.2 R80.1 R81.1 ; port 3V3
GND: IC18.1(GNDP_1) IC18.5(GNDP_2) IC18.7(GNDP_3) IC18.10(GNDP_4) J7.2 Q11.2(S) ; port GND
GND_ISO_4: C58.2 C59.2 C60.2 C61.2 DO_EZO2.1(GND) IC18.11(GNDISO_1) IC18.14(GNDISO_2) IC18.16(GNDISO_3) IC18.20(GNDISO_4) R77.1
VCC_ISO_4: C58.1 C59.1 C60.1 C61.1 DO_EZO2.4(VCC) IC18.12(VISO) IC18.17(VDDISO) R74.2 R76.2 R79.2
EN_6: Q11.1(G) R81.2 ; port EN
SCL: IC18.2(SCL2) R59.1 ; port SCL
SCL_ISO_5: DO_EZO2.3(Rx_(SCL)) IC18.19(SCL1) R74.1
SDA: IC18.3(SDA2) R75.1 ; port SDA
SDA_ISO_5: DO_EZO2.2(Tx_(SDA)) IC18.18(SDA1) R76.1
NetDO_2_1: DO_2.1 DO_EZO2.5(PRB)
NetDO_2_2: DO_2.2 DO_EZO2.6(PGND)
NetIC18_8: IC18.8(PDIS) J7.1 Q11.3(D) R80.2
NetIC18_13: IC18.13(VSEL) R77.2 R78.1
NetR78_2: R78.2 R79.1

Not connected (* = marked no-connect by the designer): IC18 6(NC_1) 15(NC_2)

### Library data of the parts
C58 C59 = Cap Semi: Capacitor (Semiconductor SIM Model); Published: 8-Jun-2000; LatestRevisionDate: 29-May-2009; LatestRevisionNote: IPC-7351 Footprint Added.; PackageReference: C1206; Publisher: Altium Limited; PackageDescription: Chip Capacitor; Value: 100nF
C60 C61 = Cap Semi: as C64 on sheet TDS_EZO_2; Published: 8-Jun-2000; LatestRevisionDate: 29-May-2009; LatestRevisionNote: IPC-7351 Footprint Added.; PackageReference: C1206; Publisher: Altium Limited; PackageDescription: Chip Capacitor
DO_2 = SMA: as TDS_2 on sheet TDS_EZO_2; Datasheet Link: https://www.mouser.com/datasheet/2/398/PCB.SMAFRA.HT_-1220750.pdf; Height: 9mm; Mouser Part Number: 960-PCB.SMAFRA.HT; Mouser Price/Stock: https://www.mouser.co.uk/ProductDetail/Taoglas/PCBSMAFRAHT?qs=RuW%2Fu%252BNMQmubIFYcN8w5Dw%3D%3D
IC18 = ADM3260ARSZ: as IC19 on sheet TDS_EZO_2; Datasheet Link: http://www.farnell.com/datasheets/2037088.pdf; Height: 2mm; Manufacturer_Part_Number: ADM3260ARSZ; Mouser Part Number: 584-ADM3260ARSZ; Mouser Price/Stock: https://www.mouser.com/Search/Refine.aspx?Keyword=584-ADM3260ARSZ; RS Part Number: 8319113P; RS Price/Stock: http://uk.rs-online.com/web/p/products/8319113P
Q11 = IRLML6244TRPBF: as Q12 on sheet TDS_EZO_2; Datasheet Link: http://www.infineon.com/dgdl/irlml6244pbf.pdf?fileId=5546d462533600a4015356686fed261f; Height: 1.12mm; Manufacturer_Part_Number: IRLML6244TRPBF; Mouser Part Number: 942-IRLML6244TRPBF; Mouser Price/Stock: https://www.mouser.com/Search/Refine.aspx?Keyword=942-IRLML6244TRPBF; RS Part Number: 7377228P; RS Price/Stock: http://at.rs-online.com/web/p/products/7377228P; Allied Price/Stock: https://www.alliedelec.com/infineon-irlml6244trpbf/70411468/
R59 R74-R81 = Res3: Resistor; Published: 8-Jun-2000; LatestRevisionDate: 29-May-2009; LatestRevisionNote: IPC-7351 Footprint Added.; PackageReference: J1-0603; Publisher: Altium Limited; PackageDescription: Chip Resistor
  R59 R74-R76: Value: 4K7
  R77-R79: Value: 1K5
  R80 R81: Value: 1M

## Sheet pH_EZO_1.SchDoc
size A4
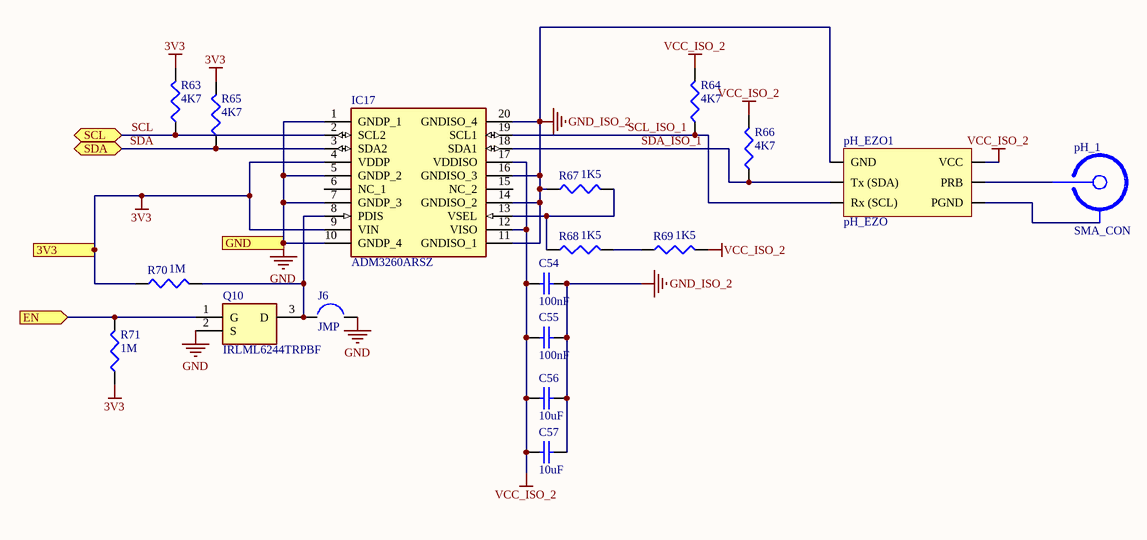
[diagram p9: pH_EZO_1.SchDoc]

### Parts
C54  100nF  [1608[0603]]
C55  100nF  [1608[0603]]
C56  10uF  [1608[0603]]
C57  10uF  [1608[0603]]
IC17  ADM3260ARSZ  [SOP65P780X200-20N]
J6  JMP  [Jumper]
pH_1  SMA_CON  [PCBSMAFRAHT]
pH_EZO1  pH_EZO  [Ph_ezo]
Q10  IRLML6244TRPBF  [SOT95P237X112-3N]
R63  4K7  [J1-0603]
R64  4K7  [J1-0603]
R65  4K7  [J1-0603]
R66  4K7  [J1-0603]
R67  1K5  [J1-0603]
R68  1K5  [J1-0603]
R69  1K5  [J1-0603]
R70  1M  [J1-0603]
R71  1M  [J1-0603]

### Ports
3V3, EN (in), GND, SCL (bidir), SDA (bidir)

### Nets
3V3: IC17.4(VDDP) IC17.9(VIN) R63.2 R65.2 R70.1 R71.1 ; port 3V3
GND: IC17.1(GNDP_1) IC17.5(GNDP_2) IC17.7(GNDP_3) IC17.10(GNDP_4) J6.2 Q10.2(S) ; port GND
GND_ISO_2: C54.2 C55.2 C56.2 C57.2 IC17.11(GNDISO_1) IC17.14(GNDISO_2) IC17.16(GNDISO_3) IC17.20(GNDISO_4) pH_EZO1.1(GND) R67.1
VCC_ISO_2: C54.1 C55.1 C56.1 C57.1 IC17.12(VISO) IC17.17(VDDISO) pH_EZO1.4(VCC) R64.2 R66.2 R69.2
EN_2: Q10.1(G) R71.2 ; port EN
SCL: IC17.2(SCL2) R63.1 ; port SCL
SCL_ISO_1: IC17.19(SCL1) pH_EZO1.3(Rx_(SCL)) R64.1
SDA: IC17.3(SDA2) R65.1 ; port SDA
SDA_ISO_1: IC17.18(SDA1) pH_EZO1.2(Tx_(SDA)) R66.1
NetIC17_8: IC17.8(PDIS) J6.1 Q10.3(D) R70.2
NetIC17_13: IC17.13(VSEL) R67.2 R68.1
NetpH_1_1: pH_1.1 pH_EZO1.5(PRB)
NetpH_1_2: pH_1.2 pH_EZO1.6(PGND)
NetR68_2: R68.2 R69.1

Not connected (* = marked no-connect by the designer): IC17 6(NC_1) 15(NC_2)

### Library data of the parts
C54 C55 = Cap Semi: Capacitor (Semiconductor SIM Model); Published: 8-Jun-2000; LatestRevisionDate: 29-May-2009; LatestRevisionNote: IPC-7351 Footprint Added.; PackageReference: C1206; Publisher: Altium Limited; PackageDescription: Chip Capacitor; Value: 100nF
C56 C57 = Cap Semi: as C64 on sheet TDS_EZO_2; Published: 8-Jun-2000; LatestRevisionDate: 29-May-2009; LatestRevisionNote: IPC-7351 Footprint Added.; PackageReference: C1206; Publisher: Altium Limited; PackageDescription: Chip Capacitor
IC17 = ADM3260ARSZ: as IC19 on sheet TDS_EZO_2; Datasheet Link: http://www.farnell.com/datasheets/2037088.pdf; Height: 2mm; Manufacturer_Part_Number: ADM3260ARSZ; Mouser Part Number: 584-ADM3260ARSZ; Mouser Price/Stock: https://www.mouser.com/Search/Refine.aspx?Keyword=584-ADM3260ARSZ; RS Part Number: 8319113P; RS Price/Stock: http://uk.rs-online.com/web/p/products/8319113P
pH_1 = SMA: as TDS_2 on sheet TDS_EZO_2; Datasheet Link: https://www.mouser.com/datasheet/2/398/PCB.SMAFRA.HT_-1220750.pdf; Height: 9mm; Mouser Part Number: 960-PCB.SMAFRA.HT; Mouser Price/Stock: https://www.mouser.co.uk/ProductDetail/Taoglas/PCBSMAFRAHT?qs=RuW%2Fu%252BNMQmubIFYcN8w5Dw%3D%3D
Q10 = IRLML6244TRPBF: as Q12 on sheet TDS_EZO_2; Datasheet Link: http://www.infineon.com/dgdl/irlml6244pbf.pdf?fileId=5546d462533600a4015356686fed261f; Height: 1.12mm; Manufacturer_Part_Number: IRLML6244TRPBF; Mouser Part Number: 942-IRLML6244TRPBF; Mouser Price/Stock: https://www.mouser.com/Search/Refine.aspx?Keyword=942-IRLML6244TRPBF; RS Part Number: 7377228P; RS Price/Stock: http://at.rs-online.com/web/p/products/7377228P; Allied Price/Stock: https://www.alliedelec.com/infineon-irlml6244trpbf/70411468/
R63-R71 = Res3: Resistor; Published: 8-Jun-2000; LatestRevisionDate: 29-May-2009; LatestRevisionNote: IPC-7351 Footprint Added.; PackageReference: J1-0603; Publisher: Altium Limited; PackageDescription: Chip Resistor
  R63-R66: Value: 4K7
  R67-R69: Value: 1K5
  R70 R71: Value: 1M

## Sheet pH_EZO_2.SchDoc
size A4
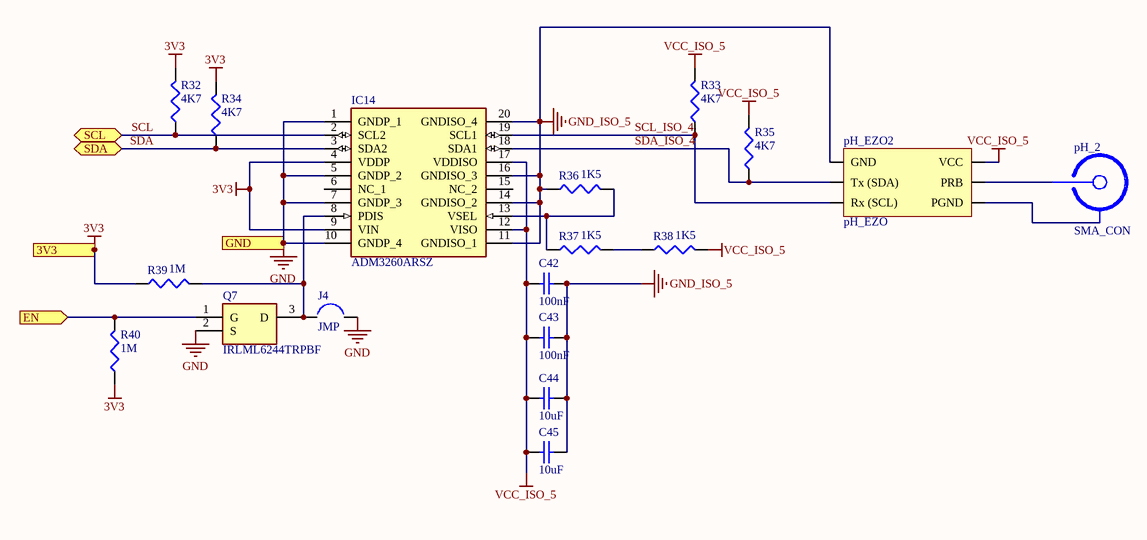
[diagram p10: pH_EZO_2.SchDoc]

### Parts
C42  100nF  [1608[0603]]
C43  100nF  [1608[0603]]
C44  10uF  [1608[0603]]
C45  10uF  [1608[0603]]
IC14  ADM3260ARSZ  [SOP65P780X200-20N]
J4  JMP  [Jumper]
pH_2  SMA_CON  [PCBSMAFRAHT]
pH_EZO2  pH_EZO  [Ph_ezo]
Q7  IRLML6244TRPBF  [SOT95P237X112-3N]
R32  4K7  [J1-0603]
R33  4K7  [J1-0603]
R34  4K7  [J1-0603]
R35  4K7  [J1-0603]
R36  1K5  [J1-0603]
R37  1K5  [J1-0603]
R38  1K5  [J1-0603]
R39  1M  [J1-0603]
R40  1M  [J1-0603]

### Ports
3V3, EN (in), GND, SCL (bidir), SDA (bidir)

### Nets
3V3: IC14.4(VDDP) IC14.9(VIN) R32.2 R34.2 R39.1 R40.1 ; port 3V3
GND: IC14.1(GNDP_1) IC14.5(GNDP_2) IC14.7(GNDP_3) IC14.10(GNDP_4) J4.2 Q7.2(S) ; port GND
GND_ISO_5: C42.2 C43.2 C44.2 C45.2 IC14.11(GNDISO_1) IC14.14(GNDISO_2) IC14.16(GNDISO_3) IC14.20(GNDISO_4) pH_EZO2.1(GND) R36.1
VCC_ISO_5: C42.1 C43.1 C44.1 C45.1 IC14.12(VISO) IC14.17(VDDISO) pH_EZO2.4(VCC) R33.2 R35.2 R38.2
EN_5: Q7.1(G) R40.2 ; port EN
SCL: IC14.2(SCL2) R32.1 ; port SCL
SCL_ISO_4: IC14.19(SCL1) pH_EZO2.3(Rx_(SCL)) R33.1
SDA: IC14.3(SDA2) R34.1 ; port SDA
SDA_ISO_4: IC14.18(SDA1) pH_EZO2.2(Tx_(SDA)) R35.1
NetIC14_8: IC14.8(PDIS) J4.1 Q7.3(D) R39.2
NetIC14_13: IC14.13(VSEL) R36.2 R37.1
NetpH_2_1: pH_2.1 pH_EZO2.5(PRB)
NetpH_2_2: pH_2.2 pH_EZO2.6(PGND)
NetR37_2: R37.2 R38.1

Not connected (* = marked no-connect by the designer): IC14 6(NC_1) 15(NC_2)

### Library data of the parts
C42 C43 = Cap Semi: Capacitor (Semiconductor SIM Model); Published: 8-Jun-2000; LatestRevisionDate: 29-May-2009; LatestRevisionNote: IPC-7351 Footprint Added.; PackageReference: C1206; Publisher: Altium Limited; PackageDescription: Chip Capacitor; Value: 100nF
C44 C45 = Cap Semi: as C64 on sheet TDS_EZO_2; Published: 8-Jun-2000; LatestRevisionDate: 29-May-2009; LatestRevisionNote: IPC-7351 Footprint Added.; PackageReference: C1206; Publisher: Altium Limited; PackageDescription: Chip Capacitor
IC14 = ADM3260ARSZ: as IC19 on sheet TDS_EZO_2; Datasheet Link: http://www.farnell.com/datasheets/2037088.pdf; Height: 2mm; Manufacturer_Part_Number: ADM3260ARSZ; Mouser Part Number: 584-ADM3260ARSZ; Mouser Price/Stock: https://www.mouser.com/Search/Refine.aspx?Keyword=584-ADM3260ARSZ; RS Part Number: 8319113P; RS Price/Stock: http://uk.rs-online.com/web/p/products/8319113P
pH_2 = SMA: as TDS_2 on sheet TDS_EZO_2; Datasheet Link: https://www.mouser.com/datasheet/2/398/PCB.SMAFRA.HT_-1220750.pdf; Height: 9mm; Mouser Part Number: 960-PCB.SMAFRA.HT; Mouser Price/Stock: https://www.mouser.co.uk/ProductDetail/Taoglas/PCBSMAFRAHT?qs=RuW%2Fu%252BNMQmubIFYcN8w5Dw%3D%3D
Q7 = IRLML6244TRPBF: as Q12 on sheet TDS_EZO_2; Datasheet Link: http://www.infineon.com/dgdl/irlml6244pbf.pdf?fileId=5546d462533600a4015356686fed261f; Height: 1.12mm; Manufacturer_Part_Number: IRLML6244TRPBF; Mouser Part Number: 942-IRLML6244TRPBF; Mouser Price/Stock: https://www.mouser.com/Search/Refine.aspx?Keyword=942-IRLML6244TRPBF; RS Part Number: 7377228P; RS Price/Stock: http://at.rs-online.com/web/p/products/7377228P; Allied Price/Stock: https://www.alliedelec.com/infineon-irlml6244trpbf/70411468/
R32-R40 = Res3: Resistor; Published: 8-Jun-2000; LatestRevisionDate: 29-May-2009; LatestRevisionNote: IPC-7351 Footprint Added.; PackageReference: J1-0603; Publisher: Altium Limited; PackageDescription: Chip Resistor
  R32-R35: Value: 4K7
  R36-R38: Value: 1K5
  R39 R40: Value: 1M

## Sheet Power.SchDoc
size A4
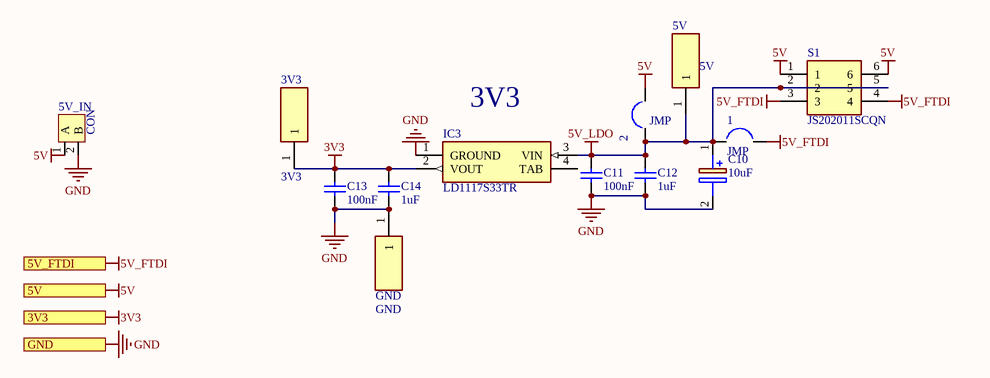
[diagram p11: Power.SchDoc]

### Parts
1  JMP  [Jumper]
2  JMP  [Jumper]
3V3  3V3  [1508000150000030]
5V  5V  [1508000150000030]
5V_IN  CON  [TBG-5.0]
C10  10uF  [CAPPM3216X180N]
C11  100nF  [1608[0603]]
C12  1uF  [1608[0603]]
C13  100nF  [1608[0603]]
C14  1uF  [1608[0603]]
GND  GND  [1508000150000030]
IC3  LD1117S33TR  [SOT230P700X180-4N]
S1  JS202011SCQN  [JS202011SCQN]

### Ports
3V3 (out), 5V (out), 5V_FTDI (in), GND

### Nets
3V3: 3V3.1 C13.1 C14.1 IC3.2(VOUT) ; port 3V3
5V: 2.2 5V_IN.1(A) S1.1 S1.6 ; port 5V
5V_FTDI: 1.2 S1.3 S1.4 ; port 5V_FTDI
5V_LDO: 1.1 2.1 5V.1 C10.1(+) C11.1 C12.1 IC3.3(VIN) S1.2 S1.5
GND: 5V_IN.2(B) C10.2(-) C11.2 C12.2 C13.2 C14.2 GND.1 IC3.1(GROUND) ; port GND

Not connected (* = marked no-connect by the designer): IC3 4(TAB)

### Notes on the sheet
- (near IC3) 3V3

### Library data of the parts
3V3 5V GND = 5015: Undefined or Miscellaneous; Manufacturer_Name: Keystone Electronics; Allied_Number: 70182998; Datasheet Link: http://www.keyelco.com/product-pdf.cfm?p=1353; Height: 1.52mm; Manufacturer_Part_Number: 5015; Mouser Part Number: 534-5015; Mouser Price/Stock: https://www.mouser.com/Search/Refine.aspx?Keyword=534-5015; Allied Price/Stock: https://www.alliedelec.com/keystone-electronics-5015/70182998/
C10 = TAJA106K004RNJ: as C5 on sheet FTDI; Datasheet Link: http://www.farnell.com/datasheets/1680476.pdf; Height: 1.8mm; Manufacturer_Part_Number: TAJA106K004RNJ; Mouser Part Number: 581-TAJA106K004R; Mouser Price/Stock: https://www.mouser.com/Search/Refine.aspx?Keyword=581-TAJA106K004R
C11 = Cap Semi: Capacitor; Value: 100pF; Published: 8-Jun-2000; LatestRevisionDate: 29-May-2009; LatestRevisionNote: IPC-7351 Footprint Added.; PackageReference: C1206; Publisher: Altium Limited; PackageDescription: Chip Capacitor
C12-C14 = Cap Semi: Capacitor; Published: 8-Jun-2000; LatestRevisionDate: 29-May-2009; LatestRevisionNote: IPC-7351 Footprint Added.; PackageReference: C1206; Publisher: Altium Limited; PackageDescription: Chip Capacitor
  C12 C14: Value: 1uF
  C13: Value: 100nF
IC3 = LD1117S33TR: Integrated Circuit; Manufacturer_Name: STMicroelectronics; Allied_Number: 70390201; Datasheet Link: http://www.st.com/st-web-ui/static/active/en/resource/technical/document/datasheet/CD00000544.pdf; Height: 1.8mm; Manufacturer_Part_Number: LD1117S33TR; Mouser Part Number: 511-LD1117S33; Mouser Price/Stock: https://www.mouser.com/Search/Refine.aspx?Keyword=511-LD1117S33; RS Part Number: 7140697P; RS Price/Stock: http://uk.rs-online.com/web/p/products/7140697P; Allied Price/Stock: http://www.alliedelec.com/stmicroelectronics-ld1117s33tr/70390201/
S1 = JS202011SCQN: Switch; Manufacturer_Name: C & K COMPONENTS; Datasheet Link: http://www.ckswitches.com/media/1422/js.pdf; Height: 5.5mm; Manufacturer_Part_Number: JS202011SCQN; Mouser Part Number: 611-JS202011SCQN; Mouser Price/Stock: https://www.mouser.co.uk/ProductDetail/CK/JS202011SCQN?qs=LgMIjt8LuD95JYWxZ7NvZA%3D%3D; Arrow Part Number: JS202011SCQN; Arrow Price/Stock: https://www.arrow.com/en/products/js202011scqn/ck

## Sheet CAN.SchDoc
size A4
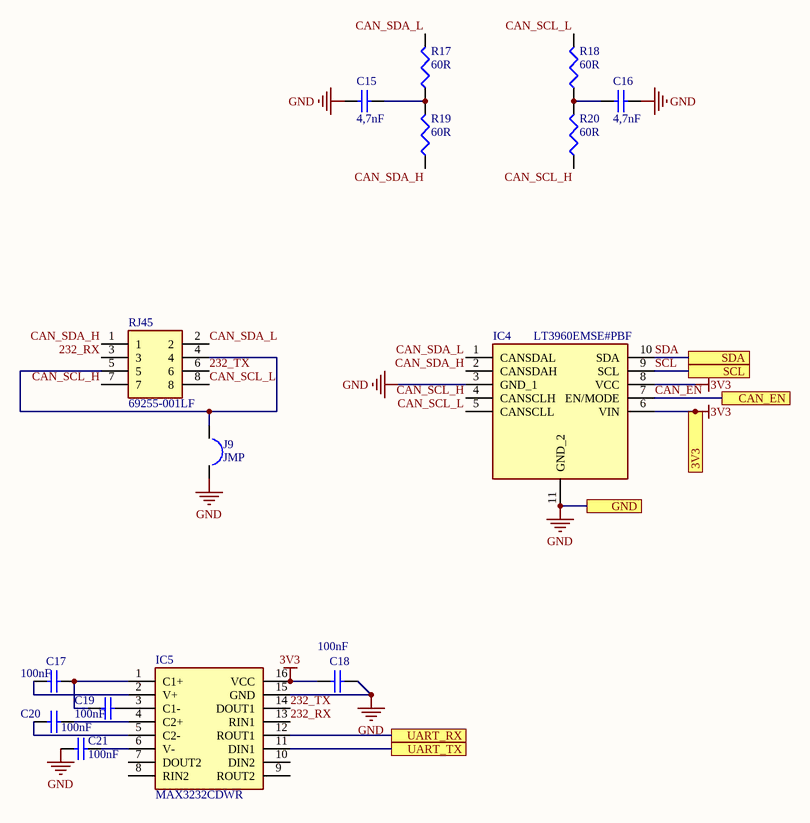
[diagram p12: CAN.SchDoc]

### Parts
C15  4,7nF  [1608[0603]]
C16  4,7nF  [1608[0603]]
C17  100nF  [1608[0603]]
C18  100nF  [1608[0603]]
C19  100nF  [1608[0603]]
C20  100nF  [1608[0603]]
C21  100nF  [1608[0603]]
IC4  LT3960EMSE#PBF  [SOP50P490X110-11N]
IC5  MAX3232CDWR  [SOIC127P1030X265-16N]
J9  JMP  [Jumper]
R17  60R  [J1-0603]
R18  60R  [J1-0603]
R19  60R  [J1-0603]
R20  60R  [J1-0603]
RJ45  69255-001LF  [69255001LF]

### Ports
3V3, CAN_EN, GND, SCL, SDA, UART_RX, UART_TX

### Nets
3V3: C18.2 IC4.6(VIN) IC4.8(VCC) IC5.16(VCC) ; port 3V3
GND: C15.1 C16.2 C18.1 C21.2 IC4.3(GND_1) IC4.11(GND_2) IC5.15(GND) J9.2 ; port GND
232_RX: IC5.13(RIN1) RJ45.3
232_TX: IC5.14(DOUT1) RJ45.6
CAN_EN: IC4.7(EN/MODE) ; port CAN_EN
CAN_SCL_H: IC4.4(CANSCLH) R20.1 RJ45.7
CAN_SCL_L: IC4.5(CANSCLL) R18.2 RJ45.8
CAN_SDA_H: IC4.2(CANSDAH) R19.1 RJ45.1
CAN_SDA_L: IC4.1(CANSDAL) R17.2 RJ45.2
SCL: IC4.9(SCL) ; port SCL
SDA: IC4.10(SDA) ; port SDA
UART_RX: IC5.12(ROUT1) ; port UART_RX
UART_TX: IC5.11(DIN1) ; port UART_TX
NetC15_2: C15.2 R17.1 R19.2
NetC16_1: C16.1 R18.1 R20.2
NetC17_1: C17.1 IC5.2(V+)
NetC17_2: C17.2 C19.2 IC5.1(C1+)
NetC19_1: C19.1 IC5.3(C1-)
NetC20_1: C20.1 IC5.4(C2+)
NetC20_2: C20.2 IC5.5(C2-)
NetC21_1: C21.1 IC5.6(V-)
NetJ9_1: J9.1 RJ45.4 RJ45.5

Not connected (* = marked no-connect by the designer): IC5 7(DOUT2) 8(RIN2) 9(ROUT2) 10(DIN2)

### Library data of the parts
C15-C21 = Cap Semi: Capacitor (Semiconductor SIM Model); Published: 8-Jun-2000; LatestRevisionDate: 29-May-2009; LatestRevisionNote: IPC-7351 Footprint Added.; PackageReference: C1206; Publisher: Altium Limited; PackageDescription: Chip Capacitor
  C15 C16: Value: 4,7nF
  C17-C21: Value: 100nF
IC4 = LT3960EMSE#PBF: Integrated Circuit; Manufacturer_Name: Analog Devices; Datasheet Link: https://www.analog.com/media/en/technical-documentation/data-sheets/lt3960.pdf; Height: 1.1mm; Manufacturer_Part_Number: LT3960EMSE#PBF; Mouser Part Number: 584-LT3960EMSE#PBF; Mouser Price/Stock: https://www.mouser.co.uk/ProductDetail/Analog-Devices/LT3960EMSEPBF?qs=T94vaHKWudT8pvtFFihmNw%3D%3D; Arrow Part Number: LT3960EMSE#PBF; Arrow Price/Stock: https://www.arrow.com/en/products/lt3960emsepbf/analog-devices?region=nac
IC5 = MAX3232CDWR: Integrated Circuit; Manufacturer_Name: Texas Instruments; Datasheet Link: http://www.ti.com/lit/gpn/max3232; Height: 2.65mm; Manufacturer_Part_Number: MAX3232CDWR; Mouser Part Number: 595-MAX3232CDWR; Mouser Price/Stock: https://www.mouser.co.uk/ProductDetail/Texas-Instruments/MAX3232CDWR?qs=0OT4q4QBUTK1ED6%2F6PqD5Q%3D%3D; Arrow Part Number: MAX3232CDWR; Arrow Price/Stock: https://www.arrow.com/en/products/max3232cdwr/texas-instruments?region=nac
R17-R20 = Res3: Resistor; Value: 120R; Published: 8-Jun-2000; LatestRevisionDate: 29-May-2009; LatestRevisionNote: IPC-7351 Footprint Added.; PackageReference: J1-0603; Publisher: Altium Limited; PackageDescription: Chip Resistor
RJ45 = 69255-001LF: Connector; Manufacturer_Name: Amphenol; Datasheet Link: https://www.mouser.de/datasheet/2/18/69255-1363180.pdf; Height: 15.77mm; Manufacturer_Part_Number: 69255-001LF; Mouser Part Number: 649-69255-001LF; Mouser Price/Stock: https://www.mouser.co.uk/ProductDetail/Amphenol-FCI/69255-001LF?qs=NPkb10g2yLBu3oVSGl%2F68w%3D%3D; Arrow Part Number: 69255-001LF; Arrow Price/Stock: https://www.arrow.com/en/products/69255-001lf/amphenol-fci

## Nets that join several sheets
3V3: MAIN (J10.2), ESP32 (11 pins), WQLT (IC16.3 R60.1 R62.2), TDS_EZO_2 (6 pins), Temp (R72.1 R73.1 Temp_1.1 Temp_2.1), DO_EZO_1 (6 pins), TDS_EZO_1 (6 pins), DO_EZO_2 (6 pins), pH_EZO_1 (6 pins), pH_EZO_2 (6 pins), Power (3V3.1 C13.1 C14.1 IC3.2), CAN (C18.2 IC4.6 IC4.8 IC5.16)
5V_FTDI: FTDI (C4.2 C5.1 FB1.1 IC2.15), Power (1.2 S1.3 S1.4)
GND: ESP32 (24 pins), FTDI (9 pins), WQLT (IC16.1 R61.2 S3.1), TDS_EZO_2 (6 pins), Temp (Temp_1.3 Temp_2.3), DO_EZO_1 (6 pins), TDS_EZO_1 (6 pins), DO_EZO_2 (6 pins), pH_EZO_1 (6 pins), pH_EZO_2 (6 pins), Power (8 pins), CAN (8 pins)
CAN_EN: MAIN (J10.1), ESP32 (IC1.13), CAN (IC4.7)
D9: ESP32 (IC1.24 R6.1), FTDI (Q1.3)
DTS: ESP32 (J1.2), FTDI (IC2.1 Q1.2 Q2.2 R14.2)
EN_1: WQLT (IC16.10), DO_EZO_1 (Q8.1 R49.2)
EN_2: WQLT (IC16.11), pH_EZO_1 (Q10.1 R71.2)
EN_3: WQLT (IC16.12), TDS_EZO_1 (Q9.1 R58.2)
EN_4: WQLT (IC16.13), TDS_EZO_2 (Q12.1 R90.2)
EN_5: WQLT (IC16.14), pH_EZO_2 (Q7.1 R40.2)
EN_6: WQLT (IC16.15), DO_EZO_2 (Q11.1 R81.2)
GPIO0: ESP32 (IC1.25 J2.1), FTDI (Q2.3)
RST: ESP32 (C1.1 IC1.3 R1.1 RST1.2), FTDI (Q3.3)
Rx: ESP32 (IC1.34 JRx1.2 JRx2.2), FTDI (R7.1)
SCL: ESP32 (I1.2 I2.2 IC1.36 R5.2), WQLT (IC16.4), TDS_EZO_2 (IC19.2 R82.1), DO_EZO_1 (IC13.2 R41.1), TDS_EZO_1 (IC15.2 R50.1), DO_EZO_2 (IC18.2 R59.1), pH_EZO_1 (IC17.2 R63.1), pH_EZO_2 (IC14.2 R32.1), CAN (IC4.9)
SDA: ESP32 (I1.3 I2.3 IC1.33 R4.2), WQLT (IC16.5), TDS_EZO_2 (IC19.3 R84.1), DO_EZO_1 (IC13.3 R43.1), TDS_EZO_1 (IC15.3 R52.1), DO_EZO_2 (IC18.3 R75.1), pH_EZO_1 (IC17.3 R65.1), pH_EZO_2 (IC14.3 R34.1), CAN (IC4.10)
Temp: ESP32 (IC1.30 Random_3_4/T.2), Temp (R72.2 R73.2 Temp_1.2 Temp_2.2)
Tx: ESP32 (IC1.35 JTx1.2 JTx2.2), FTDI (R8.1)
UART_RX: ESP32 (IC1.28 UART1.2 UART2.2), CAN (IC5.12)
UART_TX: ESP32 (IC1.27 UART1.3 UART2.3), CAN (IC5.11)